# Altium schematic sheet 1KB I2C EEPROM.SchDoc
size A4
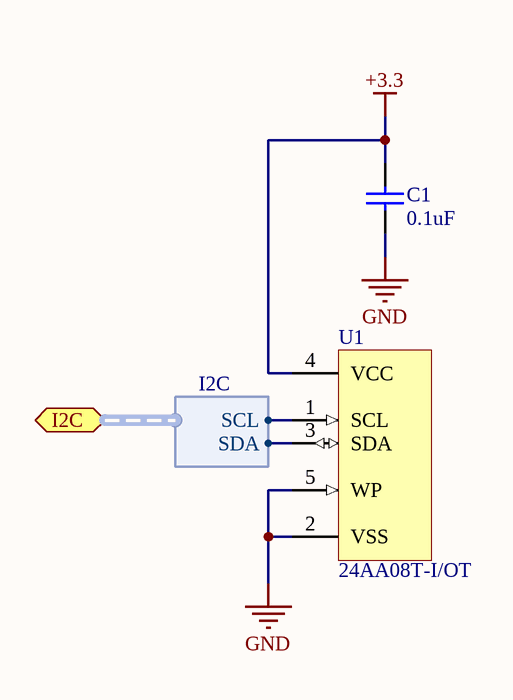
[diagram p0: 1KB I2C EEPROM.SchDoc]

## Parts
C1  value 0.1uF  [C0603]  (hidden comment: Cap)
U1  24AA08T-I/OT  [24AA08T-I/OT]

## Ports
I2C (harness I2C)

## Harnesses
I2C: SDA, SCL

## Nets
+3.3: C1.1 U1.4(VCC)
GND: C1.2 U1.2(VSS) U1.5(WP)
NetU1_1: U1.1(SCL) ; port I2C.SCL
NetU1_3: U1.3(SDA) ; port I2C.SDA

## Library data of the parts
C1 = Cap: Capacitor; farnell: 1759122
U1 = 24AA08T-I/OT: MICROCHIP - 24AA08T-I/OT - EEPROM SERIAL 8KB, SMD, SOT-23-5; farnell: 1331283